# Altium schematic sheet OSD y Memoria.SchDoc
size A4
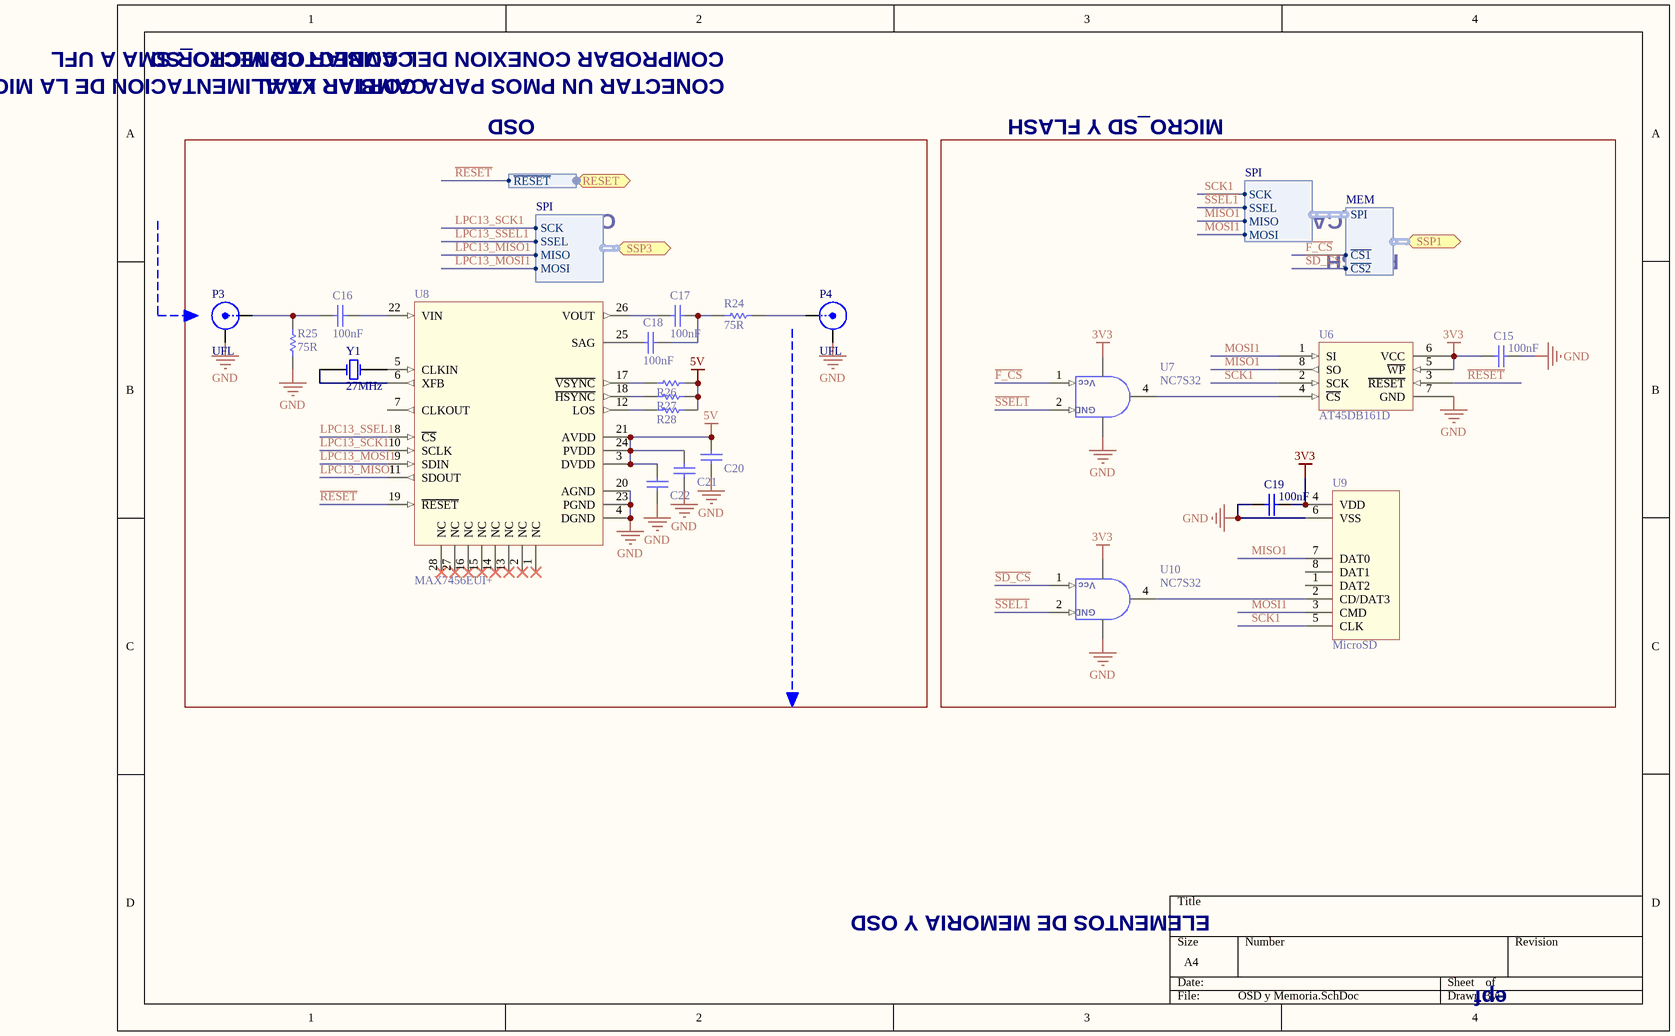
[diagram p0: OSD y Memoria.SchDoc]

## Parts
C15  value 100nF  [CAP0402]  (hidden comment: Capacitor)
C16  value 100nF  [CAP0402]  (hidden comment: Capacitor)
C17  value 100nF  [CAP0402]  (hidden comment: Capacitor)
C18  value 100nF  [CAP0402]  (hidden comment: Capacitor)
C19  value 100nF  [CAP0402]  (hidden comment: Capacitor)
C20  Capacitor  [CAP0402]  (value not drawn)
C21  Capacitor  [CAP0402]  (value not drawn)
C22  Capacitor  [CAP0402]  (value not drawn)
P3  UFL  [UFL]
P4  UFL  [UFL]
R24  value 75R  [RES0402]  (hidden comment: Resistor)
R25  value 75R  [RES0402]  (hidden comment: Resistor)
R26  Resistor  [RES0402]  (value not drawn)
R27  Resistor  [RES0402]  (value not drawn)
R28  Resistor  [RES0402]  (value not drawn)
U6  AT45DB161D  [SOIC127P600-8CN]
U7  NC7S32  [SOT23-5BN]
U8  MAX7456EUI+  [TSOP65P640-28AN]
U9  MicroSD  [101-00303]
U10  NC7S32  [SOT23-5BN]
Y1  27MHz  [HC/49US]

## Blocks framed on the sheet
OSD: C16-C18 C20-C22 P3 P4 R24-R28 U8 Y1

## Ports
RESET (harness RESET), SSP1 (harness MEM), SSP3 (harness SPI)

## Harnesses
SPI: SCK, SSEL, MISO, MOSI
RESET: ~{RESET}
MEM: SPI, ~{CS1}, ~{CS2}

## Nets
3V3: C15.1 C19.2 U6.5(~{WP}) U6.6(VCC) U7.5(VCC) U9.4(VDD) U10.5(VCC)
5V: C20.2 C21.2 C22.2 R26.2 R27.2 R28.2 U8.3(DVDD) U8.21(AVDD) U8.24(PVDD)
GND: C15.2 C19.1 C20.1 C21.1 C22.1 P3.2(Y) P4.2(Y) R25.1 U6.7(GND) U7.3(GND) U8.4(DGND) U8.20(AGND) U8.23(PGND) U9.6(VSS) U10.3(GND)
~{F_CS}: U7.1(A) ; port SSP1.~{CS1}
~{RESET}: U6.3(~{RESET}) U8.19(~{RESET}) ; port RESET.~{RESET}
~{SD_CS}: U10.1(A) ; port SSP1.~{CS2}
~{SSEL1}: U7.2(B) U10.2(B) ; harness SPI.SSEL
LPC13_MISO1: U8.11(SDOUT) ; port SSP3.MISO
LPC13_MOSI1: U8.9(SDIN) ; port SSP3.MOSI
LPC13_SCK1: U8.10(SCLK) ; port SSP3.SCK
LPC13_SSEL1: U8.8(~{CS}) ; port SSP3.SSEL
MISO1: U6.8(SO) U9.7(DAT0) ; harness SPI.MISO
MOSI1: U6.1(SI) U9.3(CMD) ; harness SPI.MOSI
SCK1: U6.2(SCK) U9.5(CLK) ; harness SPI.SCK
NetC16_1: C16.1 U8.22(VIN)
NetC16_2: C16.2 P3.1(X) R25.2
NetC17_1: C17.1 C18.1 R24.1
NetC17_2: C17.2 U8.26(VOUT)
NetC18_2: C18.2 U8.25(SAG)
NetP4_1: P4.1(X) R24.2
NetR26_1: R26.1 U8.17(~{VSYNC})
NetR27_1: R27.1 U8.18(~{HSYNC})
NetR28_1: R28.1 U8.12(LOS)
NetU6_4: U6.4(~{CS}) U7.4(Y)
NetU8_5: U8.5(CLKIN) Y1.2(OSC2)
NetU8_6: U8.6(XFB) Y1.1(OSC1)
NetU9_2: U9.2(CD/DAT3) U10.4(Y)

Not connected (* = marked no-connect by the designer): U8 1(NC)* 2(NC)* 7(CLKOUT) 13(NC)* 14(NC)* 15(NC)* 16(NC)* 27(NC)* 28(NC)*; U9 1(DAT2) 8(DAT1)

## Notes on the sheet
- CAMBIAR CONECTOR SMA A UFL
- COMPROBAR CONEXION DEL CONECTOR MICRO_SD
- CAMBIAR XTAL
- OSD
- CONECTAR UN PMOS PARA CORTAR LA ALIMENTACION DE LA MICROSD
- MICRO_SD Y FLASH
- SD_CARD
- FLASH
- ELEMENTOS DE MEMORIA Y OSD
- epf
- (in symbol NC7S32) Vcc

## Library data of the parts
C15-C19 = Cap
C20-C22 = Cap: Value: 100nF
R24 R25 = Res
R26-R28 = Res: Value: 1k
U6 = AT45DB161D: Data Flash
U7 U10 = NC7S32: OR GATE
U8 = MAX7456EUI+: OSD Display
Y1 = XTAL: Crystal Oscillator; Published: 8-Jun-2000; LatestRevisionDate: 17-Jul-2002; LatestRevisionNote: Re-released for DXP Platform.; PackageReference: R38; Publisher: Altium Limited